# EAGLE schematic babylight (EAGLE 6.4)
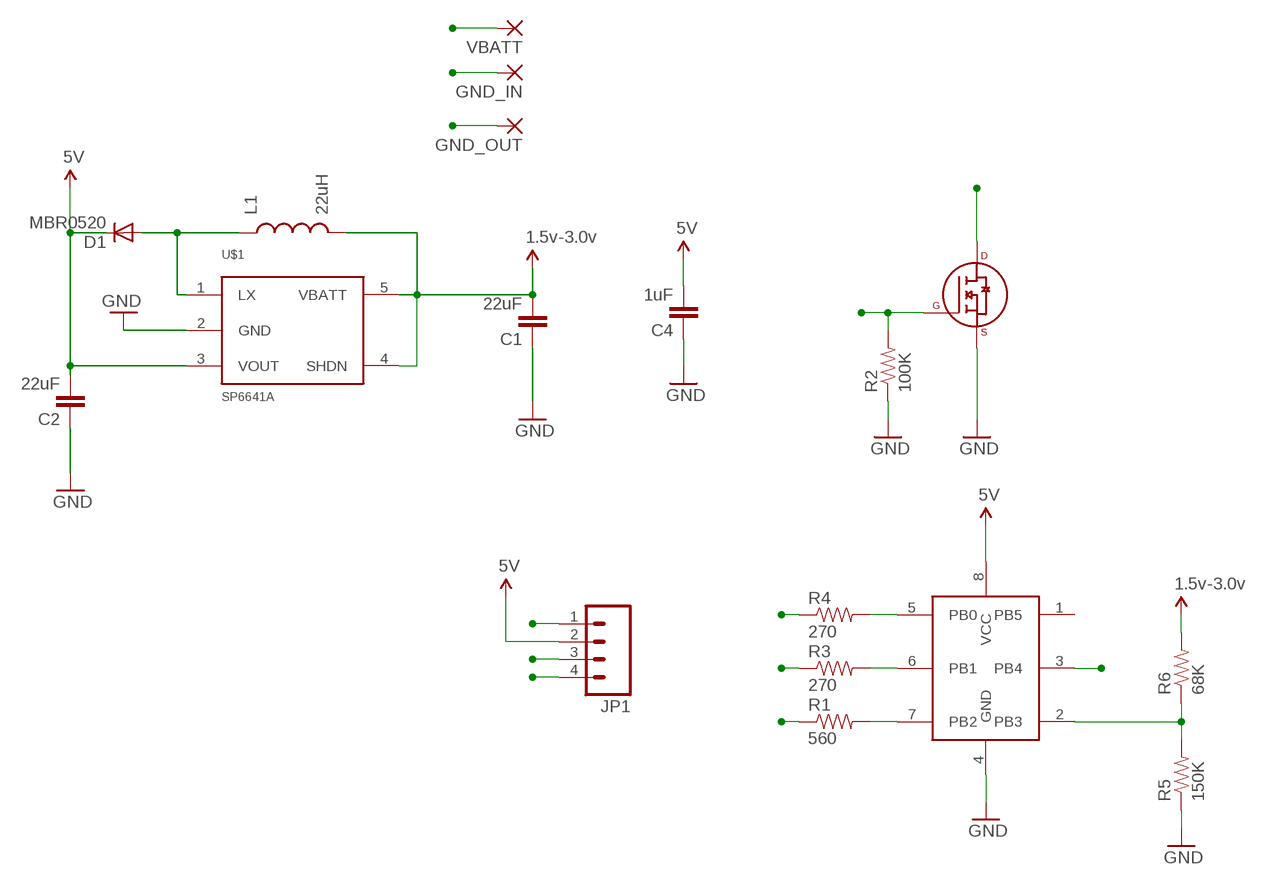
[diagram p0: schematic, sheet 1]

## Parts
C1  22uF  CAP0603-CAP  [0603-CAP]
C2  22uF  CAP0603-CAP  [0603-CAP]
C4  1uF  CAP0603-CAP  [0603-CAP]
D1  MBR0520  MBR0520LT  [SOD123]
GND_IN  WIREPAD2,54/1,0  [2,54/1,0]
GND_OUT  WIREPAD2,54/1,0  [2,54/1,0]
JP1  M04LONGPADS  [1X04_LONGPADS]
L1  22uH  INDUCTORCR54  [CR54]
R1  560  RESISTOR0805-RES  [0805]
R2  100K  RESISTOR0805-RES  [0805]
R3  270  RESISTOR0805-RES  [0805]
R4  270  RESISTOR0805-RES  [0805]
R5  150K  RESISTOR0603-RES  [0603-RES]
R6  68K  RESISTOR0603-RES  [0603-RES]
U$1  SP6641A  SP6641SP6641A/B  [SOT23-5]
U$2  ATTINY13  [WSOIC-8]
U$7  FQT13N06LTF  [SOT-223]
VBATT  WIREPAD2,54/1,0  [2,54/1,0]

## Nets
5V: C2.2 C4.2 D1.C JP1.2 U$1.3(VOUT) U$2.8(VCC)
BLU: JP1.4 R4.1
GND: C1.1 C2.1 C4.1 GND_IN.1(P) R2.1 R5.1 U$1.2(GND) U$2.4(GND) U$7.3(S)
GND_OUT: GND_OUT.1(P) U$7.4(D)
GRN: JP1.3 R3.1
N$1: R5.2 R6.1 U$2.2(PB3)
N$3: D1.A L1.P$1 U$1.1(LX)
N$6: R4.2 U$2.5(PB0)
N$7: R3.2 U$2.6(PB1)
N$8: R1.2 U$2.7(PB2)
RED: JP1.1 R1.1
SW: R2.2 U$2.3(PB4) U$7.1(G)
VBATT: C1.2 L1.P$2 R6.2 U$1.4(SHDN) U$1.5(VBATT) VBATT.1(P) ; supply symbol labelled 1.5v-3.0v
Unconnected: U$2.1(PB5)

## Library data of the parts
C1 C2 C4 = SparkFun:CAP: Capacitor Standard 0603 ceramic capacitor, and 0.1" leaded capacitor.
D1 = diode:MBR0520LT: SCHOTTKY BARRIER RECTIFIER Source: http://onsemi.com .. MBR0520LT1-D.pdf
GND_IN GND_OUT VBATT = wirepad:WIREPAD: Wire PAD connect wire on PCB
JP1 = SparkFun-Connectors:M04: Header 4 Standard 4-pin 0.1" header. Use with straight break away headers (SKU : PRT-00116), right angle break away headers (PRT-00553), swiss pins (PRT-00743), machine pins (PRT-00117), and female headers (PRT-00115). Molex polarized connector foot print use with SKU : PRT-08231 with associated crimp pins and housings. 1MM SMD Version SKU: PRT-10208
L1 = SparkFun:INDUCTOR: Inductors Basic Inductor/Choke - 0603 and 1206. Footprints are not proven and vary greatly between part numbers.
R1-R6 = SparkFun:RESISTOR: Resistor Basic schematic elements and footprints for 0603, 1206, and PTH resistors.
U$1 = Sipex Custom:SP6641
U$2 = Synapseware:ATTINY13
U$7 = Synapseware:FQT13N06LTF: 60V LOGIC N-Channel MOSFET